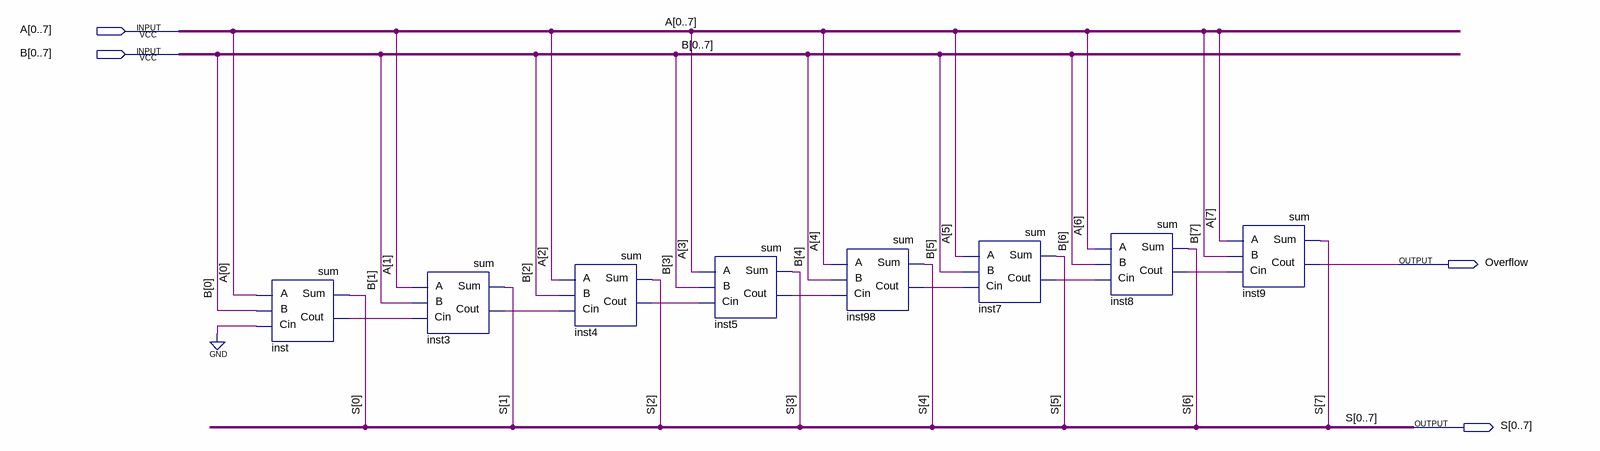
[diagram p0: schematic sheet]
// Quartus schematic Somador_8B.bdf as structural Verilog: 8 symbols, 4 pins
module Somador_8B (
  input  [0:7] A,
  input  [0:7] B,
  output Overflow,
  output [0:7] S
);

  wire inst3_cout, inst4_cout, inst5_cout, inst7_cout, inst8_cout, inst98_cout, inst_cout;

  sum inst (.A(A[0]), .B(B[0]), .Cin(1'b0), .Cout(inst_cout), .Sum(S[0]));
  sum inst3 (.A(A[1]), .B(B[1]), .Cin(inst_cout), .Cout(inst3_cout), .Sum(S[1]));
  sum inst4 (.A(A[2]), .B(B[2]), .Cin(inst3_cout), .Cout(inst4_cout), .Sum(S[2]));
  sum inst5 (.A(A[3]), .B(B[3]), .Cin(inst4_cout), .Cout(inst5_cout), .Sum(S[3]));
  sum inst98 (.A(A[4]), .B(B[4]), .Cin(inst5_cout), .Cout(inst98_cout), .Sum(S[4]));
  sum inst7 (.A(A[5]), .B(B[5]), .Cin(inst98_cout), .Cout(inst7_cout), .Sum(S[5]));
  sum inst8 (.A(A[6]), .B(B[6]), .Cin(inst7_cout), .Cout(inst8_cout), .Sum(S[6]));
  sum inst9 (.A(A[7]), .B(B[7]), .Cin(inst8_cout), .Cout(Overflow), .Sum(S[7]));
endmodule
